# Altium schematic sheet schematic.SchDoc: prototype_pcb
size A4; Author: Lohith; CompanyName: Stethaim; SheetNumber: 1; SheetTotal: 1
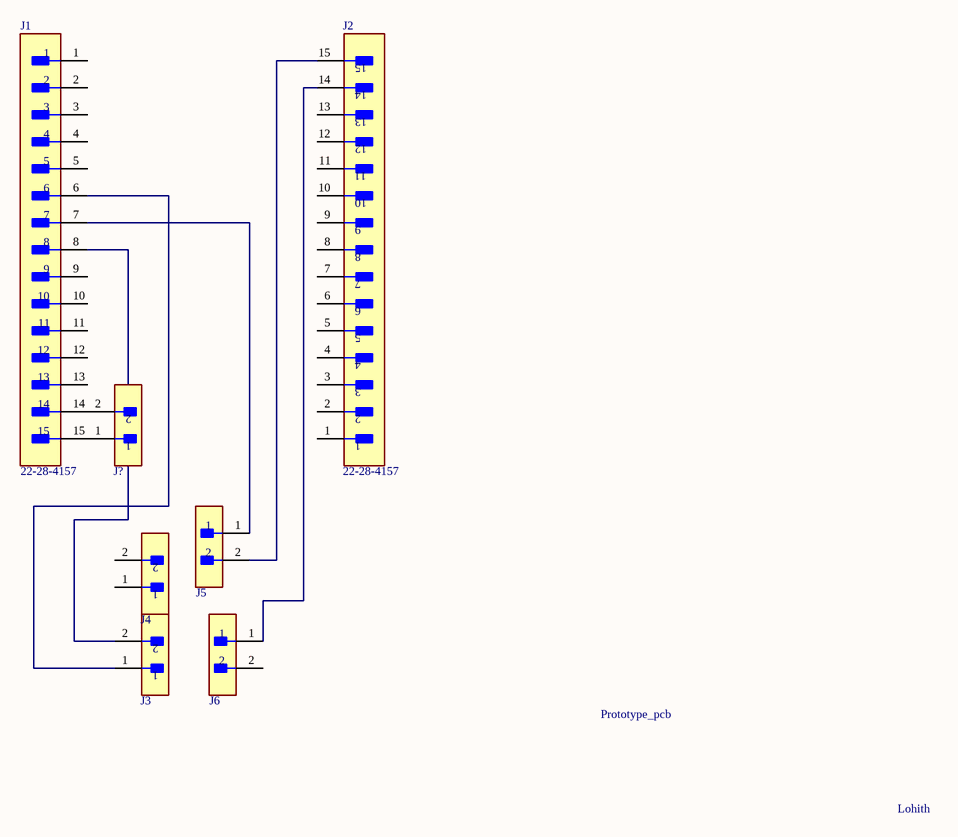
[diagram p0: schematic.SchDoc]

## Parts
J1  22-28-4157  [FP-22-28-4157-MFG]
J2  22-28-4157  [FP-22-28-4157-MFG]
J3  M20-9990245  [FP-M20-9990245-MFG]  (value not drawn)
J4  M20-9990245  [FP-M20-9990245-MFG]  (value not drawn)
J5  M20-9990245  [FP-M20-9990245-MFG]  (value not drawn)
J6  M20-9990245  [FP-M20-9990245-MFG]  (value not drawn)
J?  M20-9990245  [FP-M20-9990245-MFG]  (value not drawn)

## Nets
NetJ1_6: J1.6 J3.1
NetJ1_7: J1.7 J5.1
NetJ1_8: J1.8 J3.2
NetJ1_14: J1.14 J?.2
NetJ1_15: J1.15 J?.1
NetJ2_14: J2.14 J6.1
NetJ2_15: J2.15 J5.2

Not connected (* = marked no-connect by the designer): J1 1 2 3 4 5 9 10 11 12 13; J2 1 2 3 4 5 6 7 8 9 10 11 12 13; J4 1 2; J6 2

## Notes on the sheet
- Prototype_pcb
- Lohith

## Library data of the parts
J1 J2 = CMP-04776-000945-1: KK 100 HDR ASSY BKWY 15 CKT 30 S; Number of Circuits: 15; Max Voltage Rating (DC): 250.25kV; Connector Type: Male Pin; Current Rating: 4A; Glow Wire Compliant: Non-compliant; Contact Resistance: 20mR; Pitch: 2.54mm; Gender: Male; Voltage Rating: 250V; Contact Mating Length: 0.32inch; Packaging: Bulk; Min Operating Temperature: 0°C; Contact Material: Brass; Max Operating Temperature: 75°C; Number of Positions: 15; Housing Material: Thermoplastic; Termination: Solder; Number of Contacts: 15; Lead Free: Lead Free; Contact Plating: Gold; Color: Black; Housing Color: Black; Contact Type: Male Pin; Series: KK® 42375; Package Quantity: 1; Number of Rows: 1; Orientation: Straight; Mount: Through Hole
J3-J6 J? = CMP-15831-000105-1: CONN HEADER VERT 2POS 2.54MM; Working Voltage: 750V; Gender: Male; Number of Poles: 2; Current Rating: 3A; Mated Stacking Heights: 16.54mm; Contact Resistance: 25mR; Connector Type: Male Pin; Insulation Resistance: 10GR; Mating Cycles: 300; Voltage: 50V; Flammability Rating: UL94 V-0; Pitch: 2.54mm; Series: M20; Number of Contacts: 2; Height: 0.12inch; Min Operating Temperature: -40°C; Contact Finish - Mating: GOLD; Number of Positions: 2; Number of Rows: 1; Packaging: Bulk; Package Quantity: 1000; Voltage Rating (AC): 750V; Current: 3A; Mount: Through Hole; Case/Package: SIL; Orientation: Straight; Contact Shape: Square; Weight: 0.25lb; Radiation Hardening: No; Fastening Type: Pull; Length: 5.08mm; Depth: 2.54mm; Contact Mating Length: 0.24inch; Housing Material: Nylon; Reach SVHC Compliant: Yes; Insulation Material: Nylon; Color: Black; Width: 0.25inch; Insulation Color: Black; Contact Material: Brass; Contact Type: Male Pin; Termination: Solder; Max Operating Temperature: 105°C; Contact Plating: Gold; Housing Color: Black; Max Current Rating: 3A; Lead Pitch: 2.54mm